# EAGLE design twister (EAGLE 5.10)
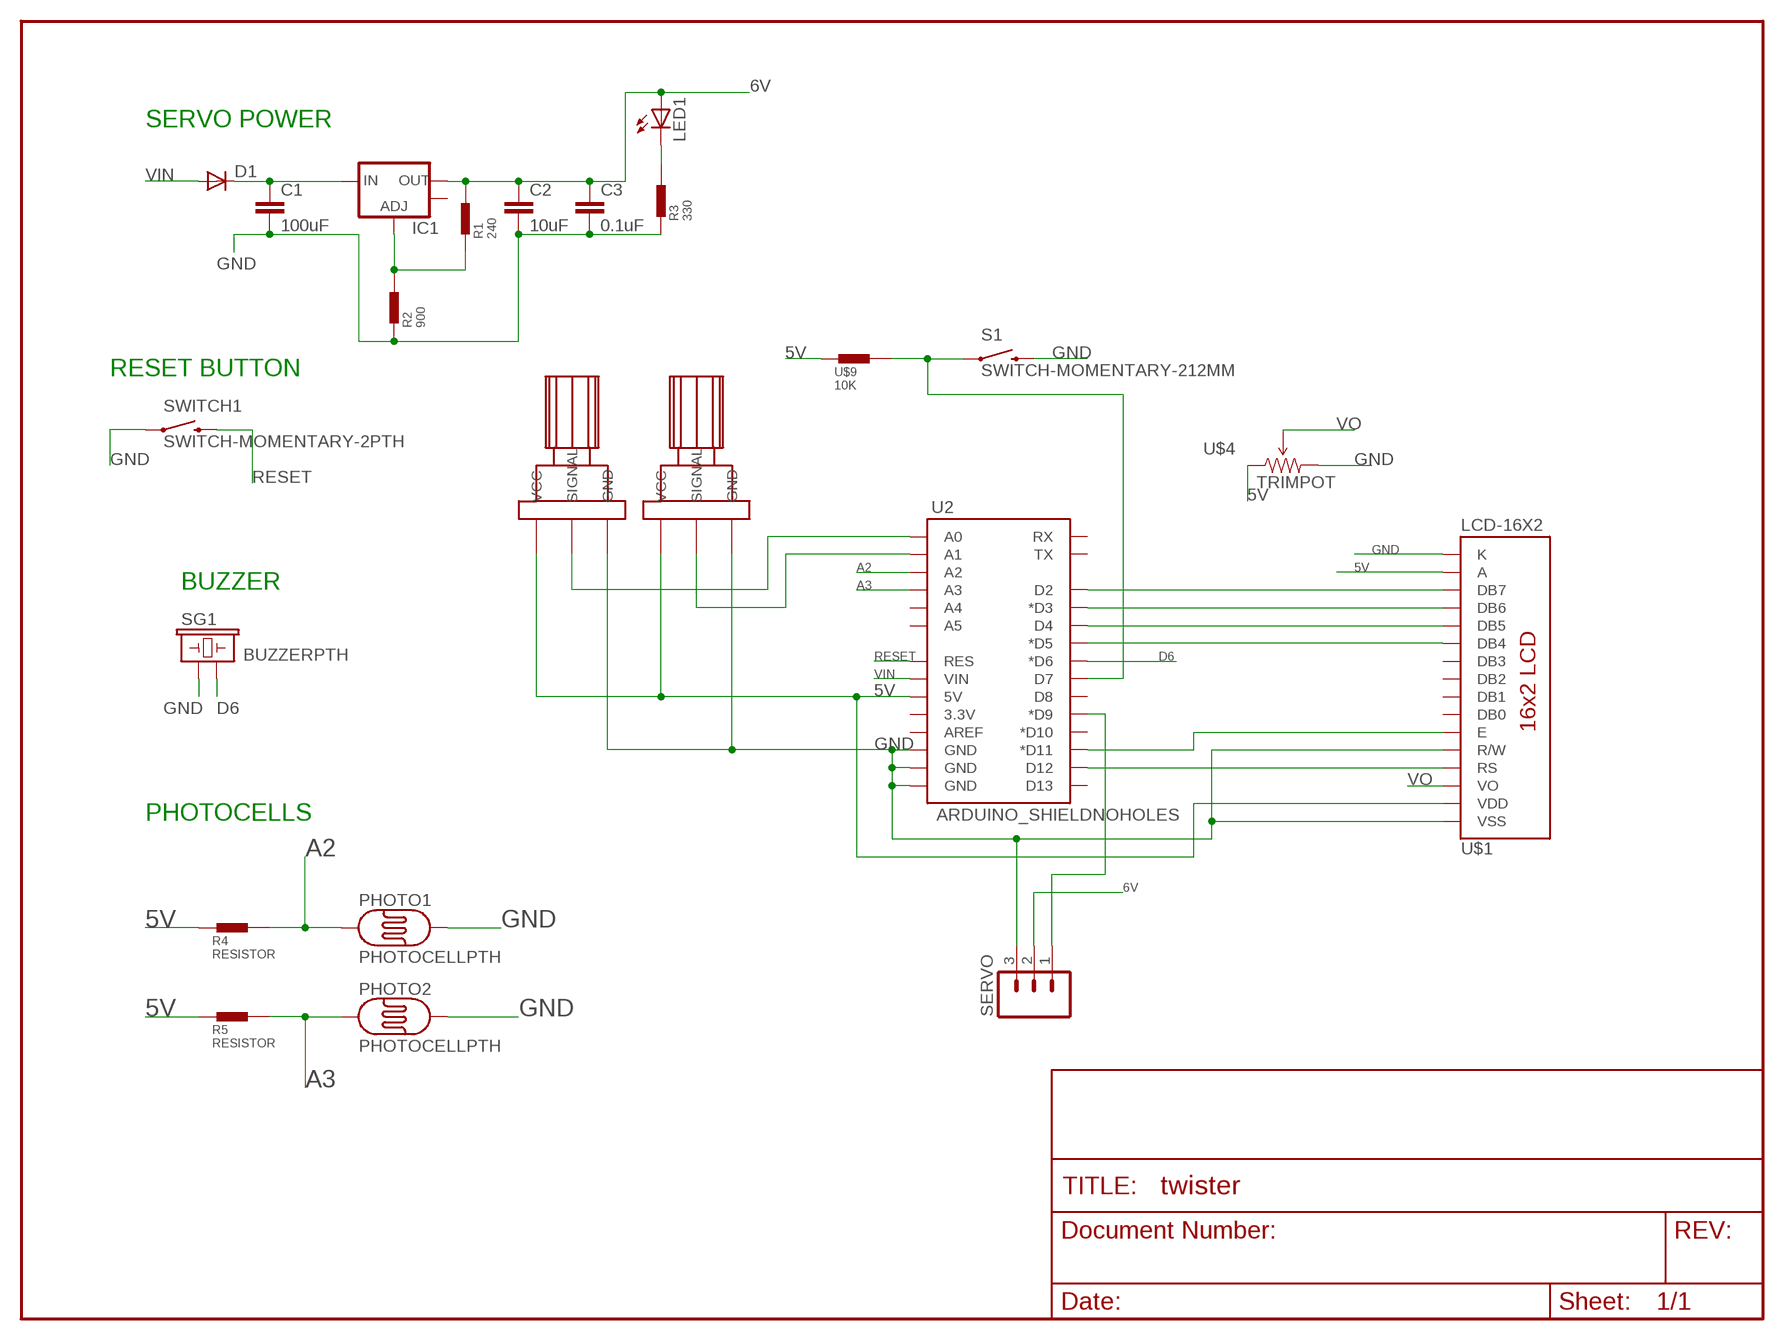
[diagram p0: schematic, sheet 1]

## Parts
C1  100uF  CAPPTH  [CAP-PTH-SMALL]
C2  10uF  CAPPTH  [CAP-PTH-SMALL]
C3  0.1uF  CAPPTH  [CAP-PTH-SMALL]
D1  DIODEPTH  [DIODE-1N4001]
IC1  V_REG_LM1117SOT223  [SOT223]
LED1  LED5MM  [LED5MM]
PHOTO1  PHOTOCELLPTH  [PHOTOCELL]
PHOTO2  PHOTOCELLPTH  [PHOTOCELL]
R1  240  RESISTOR  [RESISTOR]
R2  900  RESISTOR  [RESISTOR]
R3  330  RESISTOR  [RESISTOR]
R4  RESISTOR  [RESISTOR]
R5  RESISTOR  [RESISTOR]
S1  SWITCH-MOMENTARY-212MM  [TACTILE-PTH-12MM]
SERVO  M03PTH  [1X03]
SG1  BUZZERPTH  [BUZZER-12MM]
SWITCH1  SWITCH-MOMENTARY-2PTH  [TACTILE-PTH]
U2  ARDUINO_SHIELDNOHOLES  [DUEMILANOVE_SHIELD_NOHOLES]
U$1  LCD-16X2  [LCD-16X2]
U$4  TRIMPOT  [3362U-2]
U$9  10K  RESISTOR  [RESISTOR]
U$10  LARGE_POT  [LARGE_POT]
U$11  LARGE_POT  [LARGE_POT]

## Nets
5V: R4.P$1(P2) R5.P$1(P2) U2.5V U$1.2(VDD) U$1.15(A) U$4.1(CCW) U$9.P$1(P2) U$10.LEFT(VCC) U$11.LEFT(VCC)
6V: C2.1 C3.1 IC1.2(OUT) LED1.A R1.P$2(P1) SERVO.2
A2: PHOTO1.1 R4.P$2(P1) U2.A2
A3: PHOTO2.1 R5.P$2(P1) U2.A3
D6: SG1.- U2.D6(*D6)
GND: C1.2 C2.2 C3.2 PHOTO1.2 PHOTO2.2 R2.P$1(P2) R3.P$1(P2) S1.3 SERVO.3 SG1.+ SWITCH1.1 U2.GND@0(GND) U2.GND@1(GND) U2.GND@2(GND) U$1.1(VSS) U$1.5(R/W) U$1.16(K) U$4.3(CW) U$10.RIGHT(GND) U$11.RIGHT(GND)
N$1: C1.1 D1.C IC1.3(IN)
N$3: LED1.K(C) R3.P$2(P1)
N$4: U2.D12 U$1.4(RS)
N$5: U2.D11(*D11) U$1.6(E)
N$6: U2.D5(*D5) U$1.11(DB4)
N$7: U2.D4 U$1.12(DB5)
N$8: U2.D3(*D3) U$1.13(DB6)
N$9: U2.D2 U$1.14(DB7)
N$10: U2.A0 U$10.CENTER(SIGNAL)
N$11: U2.A1 U$11.CENTER(SIGNAL)
N$12: S1.1 U2.D7 U$9.P$2(P1)
N$13: SERVO.1 U2.D9(*D9)
N$17: IC1.1(ADJ) R1.P$1(P2) R2.P$2(P1)
RESET: SWITCH1.3 U2.RES
VIN: D1.A U2.VIN
VO: U$1.3(VO) U$4.2(WIPER)
Unconnected: IC1.4(OUT) U2.3.3V U2.A4 U2.A5 U2.AREF U2.D8 U2.D10(*D10) U2.D13 U2.RX U2.TX U$1.7(DB0) U$1.8(DB1) U$1.9(DB2) U$1.10(DB3)

## Notes on the sheet
- SERVO POWER
- RESET BUTTON
- BUZZER
- PHOTOCELLS

## Library data of the parts
C1-C3 = sparkfun:CAP: Capacitor Standard 0603 ceramic capacitor, and 0.1" leaded capacitor.
D1 = sparkfun:DIODE: Diode These are standard reverse protection diodes and small signal diodes. SMA package can handle up to about 1A. SOD-323 can handle about 200mA. What the SOD-323 package when ordering, there are some mfgs out there that are 5-pin packages.
IC1 = sparkfun:V_REG_LM1117: Voltage Regulator LM1117 Standard adjustable voltage regulator but in SMD form. Spark Fun Electronics SKU : COM-00595
LED1 = sparkfun:LED: LEDs Standard schematic elements and footprints for 5mm, 3mm, 1206, and 0603 sized LEDs. 5mm - Spark Fun Electronics SKU : COM-00529 (and others)
PHOTO1 PHOTO2 = sparkfun:PHOTOCELL
R1-R5 U$9 = josh:RESISTOR
S1 SWITCH1 = sparkfun:SWITCH-MOMENTARY-2
SERVO = sparkfun:M03: Header 3 Standard 3-pin 0.1" header. Use with straight break away headers (SKU : PRT-00116), right angle break away headers (PRT-00553), swiss pins (PRT-00743), machine pins (PRT-00117), and female headers (PRT-00115). Molex polarized connector foot print use with SKU : PRT-08232 with associated crimp pins and housings.
SG1 = sparkfun:BUZZER: Buzzer 12mm Spark Fun Electronics SKU : Comp-Buzzer
U2 = sparkfun:ARDUINO_SHIELD
U$1 = sparkfun:LCD-16X2
U$4 = sparkfun:TRIMPOT
U$10 U$11 = josh:LARGE_POT

## Board
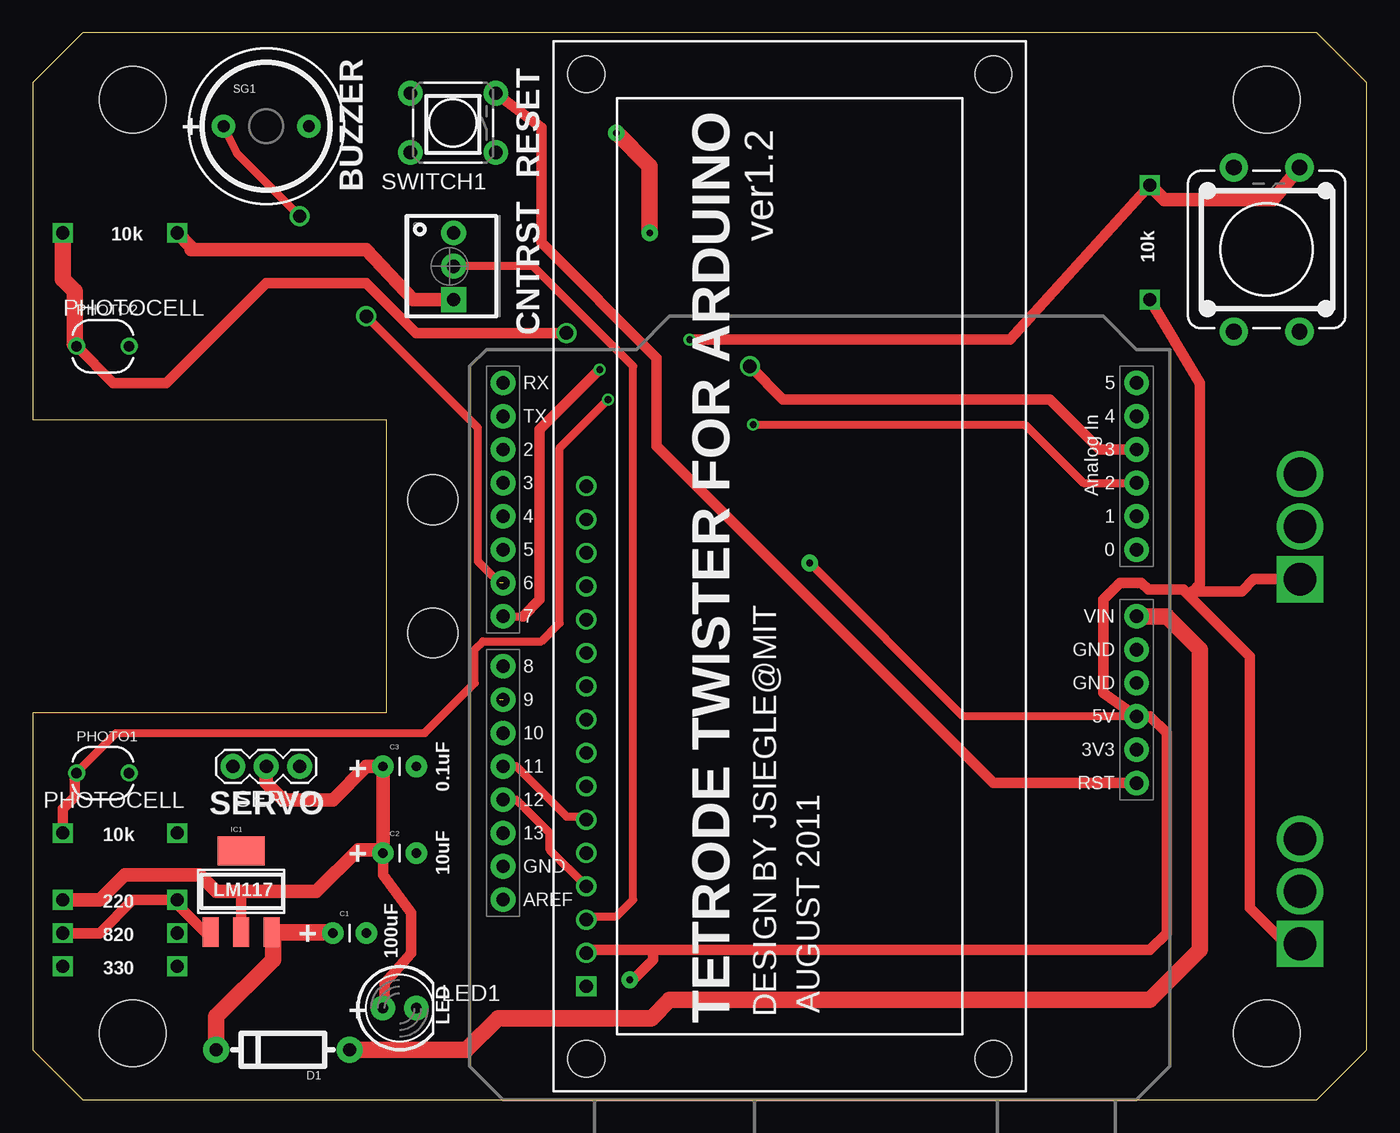
[diagram p1: board, top side]
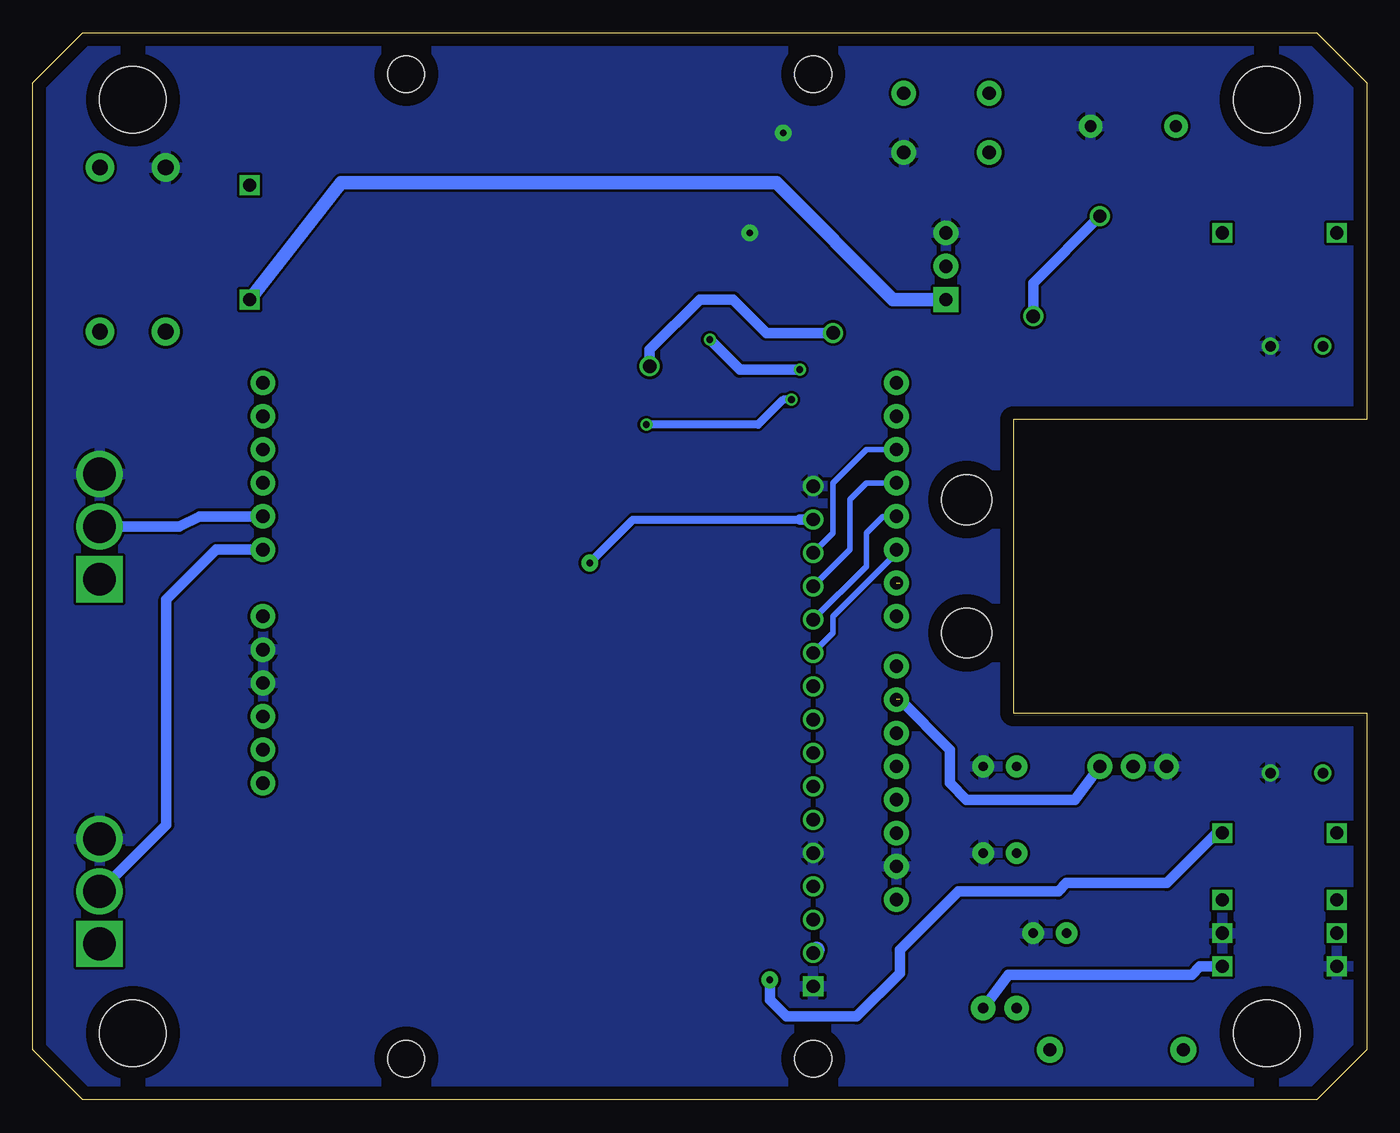
[diagram p2: board, bottom side, seen from below]

Size 101.6 x 81.28 mm. Coordinates in mm from the lower left corner, seen from the top.
Outline: 101.6,3.81 97.79,0 3.81,0 0,3.81 0,29.46 26.92,29.46 26.92,51.82 0,51.82 0,77.47 3.81,81.28 97.79,81.28 101.6,77.47
Outline: 101.6,3.81 101.6,3.81
Outline: 101.6,3.81 101.6,77.47
Outline: 101.6,77.47 101.6,77.47
Copper layers (1*16): Top 0.035mm / dielectric 1.5mm / Bottom 0.035mm
Design rules "default *": minimum track width 10mil, minimum drill 20mil, track to track 8mil, track to pad 8mil, pad to pad 8mil, via to via 8mil, smd to smd 8mil, copper to edge 40mil, drill to drill 8mil, minimum pad ring 10mil, minimum via ring 8mil, stop-mask expansion 4mil, vias tented up to drill 0mil, thermal gap 10mil
Holes 5.08 mm at 7.62,76.2 7.62,5.08 93.98,76.2 93.98,5.08
Holes 3.81 mm at 30.48,35.56 30.48,45.72

### Footprints (pad centres in the part's own frame; a part is rotated, then mirrored left to right if it is on the bottom)
CAP-PTH-SMALL = drill 0.7 pad 1.651 round: 1 0,0; 2 2.54,0
DIODE-1N4001 = drill 1 pad 1.981 round: A -5.08,0; C 5.08,0
SOT223 = smd 1.219 x 2.235: 1 -2.311,-3.099; 2 0,-3.099; 3 2.311,-3.099 | smd 3.6 x 2.2: 4 0,3.099
LED5MM = drill 0.813 pad 1.88 round: A -1.27,0; K 1.27,0
PHOTOCELL = drill 0.8 round: 1 -2,0; 2 2,0
RESISTOR = drill 1 square: P$1 -2.54,0; P$2 6.175,0
TACTILE-PTH-12MM = drill 1.2 pad 2.159 round: 1 6.25,-2.5; 2 -6.25,-2.5; 3 6.25,2.5; 4 -6.25,2.5
1X03 = drill 1.016 pad 1.88 round: 1 0,0; 2 2.54,0; 3 5.08,0
BUZZER-12MM = drill 0.9 pad 1.778 round: + 3.25,0; - -3.25,0
TACTILE-PTH = drill 1.016 pad 1.88 round: 1 -3.251,2.261; 2 3.251,2.261; 3 -3.251,-2.261; 4 3.251,-2.261
DUEMILANOVE_SHIELD_NOHOLES = drill 1.016 pad 1.88 round: 3.3V 50.8,26.67; 5V 50.8,29.21; A0 50.8,41.91; A1 50.8,44.45; A2 50.8,46.99; A3 50.8,49.53; A4 50.8,52.07; A5 50.8,54.61; AREF 2.54,15.24; D2 2.54,49.53; D3 2.54,46.99; D4 2.54,44.45; D5 2.54,41.91; D6 2.54,39.37; D7 2.54,36.83; D8 2.54,33.02; D9 2.54,30.48; D10 2.54,27.94; D11 2.54,25.4; D12 2.54,22.86; D13 2.54,20.32; GND@0 50.8,31.75; GND@1 50.8,34.29; GND@2 2.54,17.78; RES 50.8,24.13; RX 2.54,54.61; TX 2.54,52.07; VIN 50.8,36.83
LCD-16X2 = drill 1.016 square: 1 -32,15.5 | drill 1.016 round: 2 -29.46,15.5; 3 -26.92,15.5; 4 -24.38,15.5; 5 -21.84,15.5; 6 -19.3,15.5; 7 -16.76,15.5; 8 -14.22,15.5; 9 -11.68,15.5; 10 -9.14,15.5; 11 -6.6,15.5; 12 -4.06,15.5; 13 -1.52,15.5; 14 1.02,15.5; 15 3.56,15.5; 16 6.1,15.5 | hole 2.8: -37.5,15.5; -37.5,-15.5; 37.5,15.5; 37.5,-15.5
3362U-2 = drill 1.016 pad 1.88 square: 1 -2.54,-0.305 | drill 1.016 pad 1.88 round: 2 0,-0.305; 3 2.54,-0.305
LARGE_POT = drill 2.5 pad 3 round: CENTER 0,0; RIGHT 4,0 | drill 2.5 pad 3 square: LEFT -4,0

### Placement (x,y rotation side)
C1  22.86,12.7 0 top
C2  26.67,18.8 0 top
C3  26.67,25.4 0 top
D1  19.05,3.81 180 top
IC1  15.88,15.88 0 top
LED1  27.94,6.99 0 top
PHOTO1  5.33,24.89 0 top
PHOTO2  5.33,57.4 0 top
R1  8.45,15.24 180 top
R2  8.45,12.7 180 top
R3  4.83,10.16 0 top
R4  8.45,20.32 180 top
R5  8.45,66.04 180 top
S1  93.98,64.77 90 top
SERVO  20.32,25.4 180 top
SG1  17.78,74.17 0 top
SWITCH1  32,74.42 180 top
U2  33.27,0 0 top
U$1  57.66,40.64 90 top
U$4  31.75,63.5 90 top
U$9  85.09,63.5 90 top
U$10  96.52,15.88 90 top
U$11  96.52,43.66 90 top

### Tracks (layer width: path | path; a pad name or v marks a point on that pad's centre or on a via)
5V  (via drill 0.51 pad 1.27)
  Top 0.254: 12.06,64.77 12.06,64.96
  Top 0.61: U2.5V 76.2,29.21 70.86,29.21 v59.18,40.89
  Top 0.813: U$10.LEFT 95.81,11.51 92.71,14.61 92.71,33.78 87.83,38.66 | U$9.P$1 88.9,54.61 88.9,39.3 88.27,38.66 | 87.83,38.66 88.27,38.66 | 88.27,38.66 88.27,38.73 92.08,38.73 93,39.66 U$11.LEFT | 87.83,38.66 87.63,38.86 84.96,38.86 84.45,39.37 82.8,39.37 81.53,38.1 81.53,30.99 U2.5V 85.09,29.21 86.36,27.94 86.36,12.7 85.09,11.43 47.24,11.43 | 47.24,11.43 42.41,11.43 U$1.2 | v45.47,9.14 45.72,9.14 47.24,10.67 47.24,11.43
  Top 1.016: U$4.1 28.96,60.96 25.4,64.77 12.06,64.77 | 12.06,64.96 R5.P$1
  Bottom 0.61: 43.18,44.2 55.88,44.2 v59.18,40.89
  Bottom 0.813: R4.P$1 11.43,20.32 15.24,16.51 22.86,16.51 23.5,15.88 31.11,15.88 35.56,11.43 35.56,9.65 38.86,6.35 44.2,6.35 45.47,7.62 v45.47,9.14 | 43.18,44.2 U$1.15
  Bottom 1.016: U$9.P$1 78.11,69.85 44.96,69.85 36.07,60.96 U$4.1
  Bottom 1.27: U$1.2 41.91,11.43
6V
  Top 0.813: 15.88,15.88 IC1.2 | C2.1 26.67,17.14 28.83,14.22 28.83,11.18 26.8,8.89 26.8,7.62 LED1.A
  Top 1.016: R1.P$2 5.08,15.24 6.99,17.14 12.7,17.14 13.97,15.88 15.88,15.88 21.59,15.88 24.77,19.05 26.42,19.05 C2.1 C3.1 25.4,25.4 22.86,22.86 19.05,22.86 17.78,24.13 SERVO.2
A2  (via drill 0.51)
  Top 0.61: PHOTO1.1 3.33,24.92 6.35,27.94 29.84,27.94 33.66,31.75 33.66,34.29 34.29,34.92 38.73,34.92 40.13,36.32 40.13,49.66 v43.81,53.34 | v54.86,51.44 75.56,51.44 80.01,46.99 U2.A2
  Top 0.813: R4.P$2 2.27,22.16 3.17,23.06 3.17,24.73 PHOTO1.1
  Bottom 0.61: v43.81,53.34 44.45,53.34 46.35,51.44 v54.86,51.44
A3  (via drill 1.02)
  Top 0.254: PHOTO2.1 2.79,57.4
  Top 0.813: v40.64,58.42 29.21,58.42 25.4,62.23 17.78,62.23 10.16,54.61 6.13,54.61 PHOTO2.1 | v54.61,55.88 57.15,53.34 77.47,53.34 81.28,49.53 U2.A3
  Top 1.27: R5.P$2 2.27,62.5 3.17,61.59 3.17,57.56 PHOTO2.1
  Bottom 0.813: v40.64,58.42 45.72,58.42 48.26,60.96 50.8,60.96 54.61,57.15 v54.61,55.88
D6  (via drill 1.02)  (1 unrouted)
  Top 0.61: 35.56,39.37 33.91,41.02 33.91,51.18 v25.4,59.69 | SG1.- 15.55,72.08 v20.32,67.31
  Bottom 0.813: v25.4,59.69 25.4,62.23 v20.32,67.31
GND  (via drill 0.51 pad 1.27)
  Top 1.27: v44.45,73.66 46.99,71.12 v46.99,66.04
  pour Bottom: 0,77.22 0,51.82 0.25,51.56 26.92,51.56 27.43,51.05 27.43,29.46 0,29.46 0,3.81 -0.51,3.3 0,3.3 3.81,-0.51 97.79,-0.51 101.85,3.56 101.85,77.22 97.54,81.53 4.06,81.53 3.81,81.28
N$1
  Top 1.27: D1.C 13.97,6.35 18.29,10.67 18.29,12.68 IC1.3 22.78,12.78 C1.1
N$3
  Bottom 0.813: R3.P$2 12.7,10.16 13.34,9.53 27.3,9.53 LED1.K
N$4
  Top 0.61: U$1.4 39.37,19.05 39.37,20.32 36.83,22.86 U2.D12
N$5
  Top 0.61: U$1.6 41.91,21.59 40.64,21.59 36.83,25.4 U2.D11
N$6
  Bottom 0.406: U$1.11 40.64,35.56 40.64,36.83 35.81,41.66 U2.D5
N$7
  Bottom 0.406: U$1.12 38.1,40.64 38.1,43.18 36.83,44.45 U2.D4
N$8
  Bottom 0.406: 41.91,39.37 39.37,41.91 39.37,45.72 38.1,46.99 U2.D3 | U$1.13 41.91,39.37
  Bottom 0.813: 41.91,39.37
N$9
  Bottom 0.406: U$1.14 40.64,43.18 40.64,46.99 38.1,49.53 U2.D2
N$10
  Bottom 0.813: U$10.CENTER 91.44,20.95 91.44,38.1 87.63,41.91 U2.A0
N$11
  Bottom 0.813: U$11.CENTER 90.44,43.66 88.9,44.45 U2.A1
N$12  (via drill 0.51)
  Top 0.61: U2.D7 37.34,36.83
  Top 0.813: 37.34,36.83 38.61,38.1 38.61,51.05 v43.18,55.63 | v50.04,57.91 74.42,57.91 U$9.P$2
  Top 1.016: S1.1 94.47,68.58 86.19,68.58 U$9.P$2
  Bottom 0.813: v43.18,55.63 47.75,55.63 v50.04,57.91
N$13  (1 unrouted)
  Bottom 0.813: 35.56,30.48 31.75,26.67 31.75,24.13 30.48,22.86 22.23,22.86 SERVO.1
N$17
  Top 0.813: R2.P$2 5.08,12.7 7.62,15.24 R1.P$1 10.67,15.24 13.13,12.78 IC1.1
RESET
  Top 0.813: SWITCH1.3 38.73,74.07 38.73,65.28 47.5,56.52 47.5,49.78 73.15,24.13 U2.RES
VIN
  Top 1.27: U2.VIN 86.36,36.83 88.9,34.29 88.9,11.43 85.09,7.62 48.51,7.62 47.12,6.22 35.43,6.22 33.02,3.81 D1.A
VO
  Top 0.61: U$4.2 38.1,63.5 45.72,55.88 45.72,15.24 44.45,13.97 42.41,13.97 U$1.3

### Text on the board
_tsilk: RESET | + | BUZZER | CNTRST | 10k | ver1.2 | 10k | PHOTOCELL | + | PHOTOCELL | SERVO | 0.1uF | 10k | + | 10uF | 220 | LM117 | 820 | + | 100uF | 330 | AUGUST 2011 | + | LED | TETRODE TWISTER FOR ARDUINO | DESIGN BY JSIEGLE@MIT